# Altium schematic sheet SH9 - MICROCONTROLLER.SchDoc: Power Distribution Board Rev2 - MCU
size Letter; DrawnBy: Cindy Li; Organization: UW Robotics; Address1: 200 University Avenue; Address2: Waterloo; Address3: Ontario; Address4: Canada N2L 3G6; DocumentNumber: 9; SheetNumber: 9; SheetTotal: 11
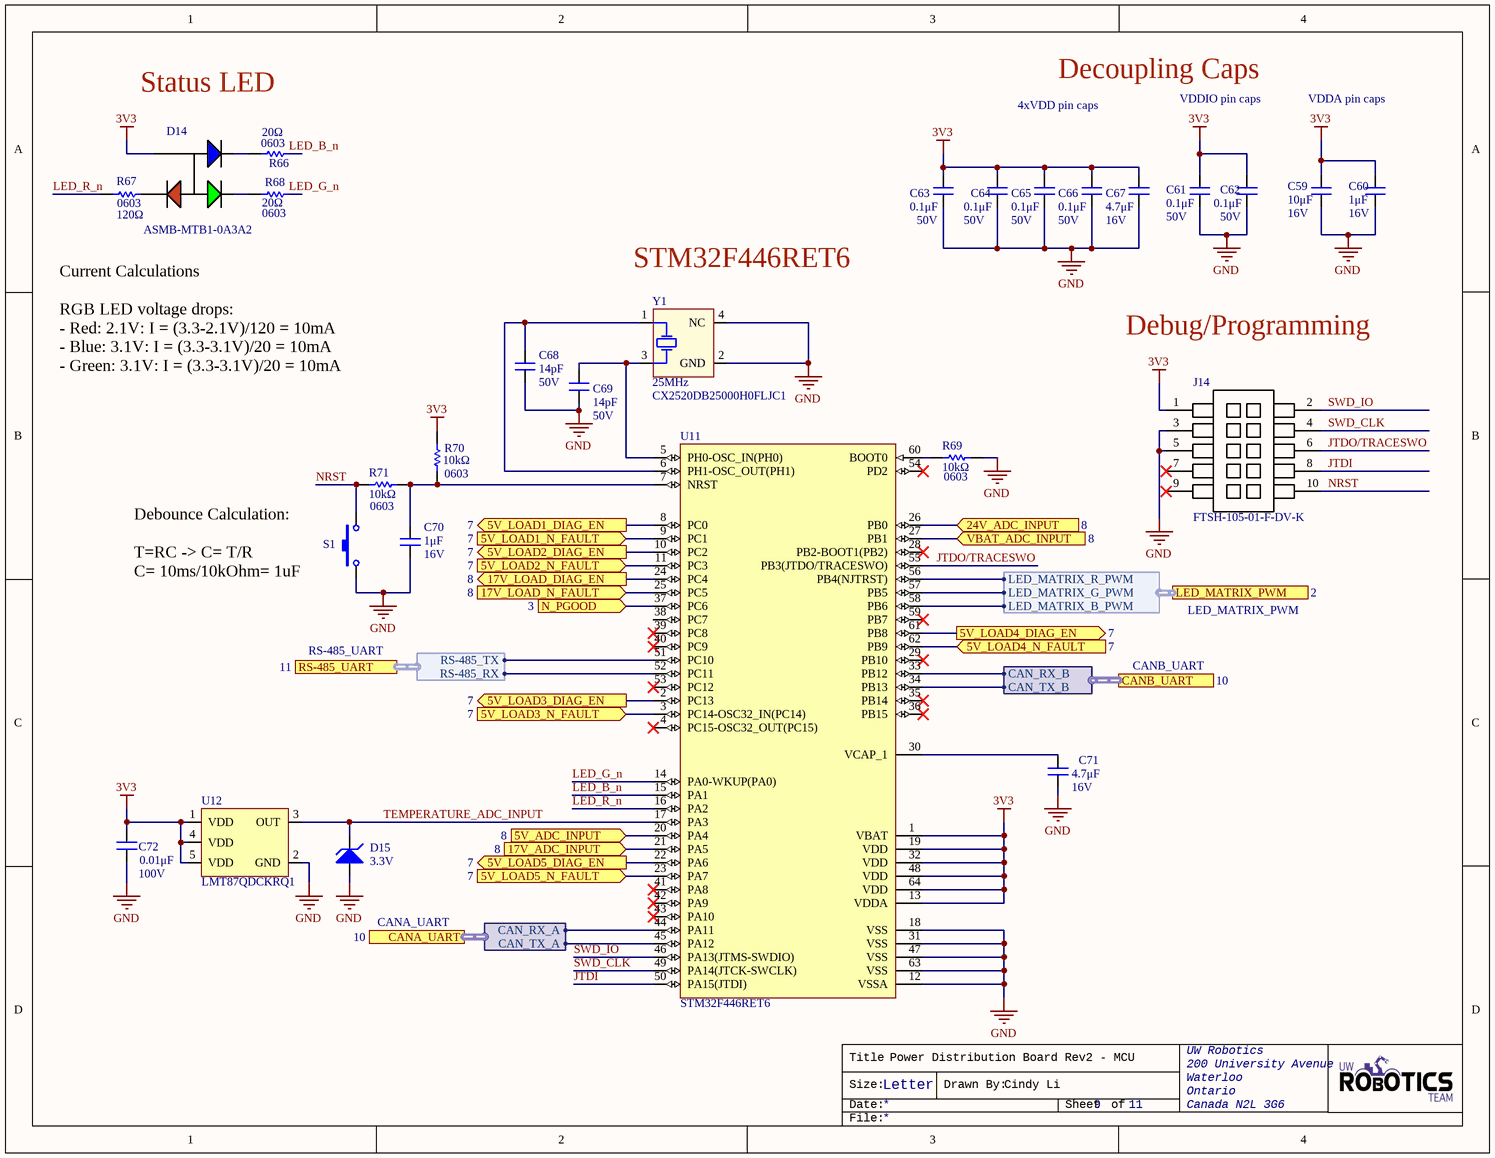
[diagram p0: SH9 - MICROCONTROLLER.SchDoc]

## Parts
C59  value 10μF  Voltage Rating: 16V  [CAP0603]  (hidden comment: CAP_10nF_0603)
C60  value 1μF  Voltage Rating: 16V  [CAP0603]  (hidden comment: CAP_1uF_16V_0603)
C61  value 0.1μF  Voltage Rating: 50V  [CAP0603]  (hidden comment: CAP_0.1uF_50V_0603)
C62  value 0.1μF  Voltage Rating: 50V  [CAP0603]  (hidden comment: CAP_0.1uF_50V_0603)
C63  value 0.1μF  Voltage Rating: 50V  [CAP0603]  (hidden comment: CAP_0.1uF_50V_0603)
C64  value 0.1μF  Voltage Rating: 50V  [CAP0603]  (hidden comment: CAP_0.1uF_50V_0603)
C65  value 0.1μF  Voltage Rating: 50V  [CAP0603]  (hidden comment: CAP_0.1uF_50V_0603)
C66  value 0.1μF  Voltage Rating: 50V  [CAP0603]  (hidden comment: CAP_0.1uF_50V_0603)
C67  value 4.7μF  Voltage Rating: 16V  [CAP2012]  (hidden comment: CAP_4.7uF_16V_0805)
C68  value 14pF  Voltage Rating: 50V  [CAP0603]  (hidden comment: CAP_14pF_50V_0603)
C69  value 14pF  Voltage Rating: 50V  [CAP0603]  (hidden comment: CAP_14pF_50V_0603)
C70  value 1μF  Voltage Rating: 16V  [CAP2012]  (hidden comment: CAP_1uF_16V_0805)
C71  value 4.7μF  Voltage Rating: 16V  [CAP2012]  (hidden comment: CAP_4.7uF_16V_0805)
C72  value 0.01μF  Voltage Rating: 100V  [CAP0603]  (hidden comment: CAP_0.01uF_100V_0603)
D14  Manufacturer Part Number 1: ASMB-MTB1-0A3A2  [LED_RGB]  (hidden comment: LED_RGB)
D15  Reverse Standoff Voltage: 3.3V  [SOD523_UNI]  (hidden comment: ESD5Z3.3T1G)
J14  Manufacturer Part Number 1: FTSH-105-01-F-DV-K  [FTSH-105-01-F-DV-K-P-TR]  (hidden comment: CON_PROGRAMMING)
R66  value 20Ω  Case Code (Imperial): 0603  [RESC0603(1608)_N]  (hidden comment: RES_20Ω_0603)
R67  value 120Ω  Case Code (Imperial): 0603  [RESC0603(1608)_N]  (hidden comment: RES_120Ω_0603)
R68  value 20Ω  Case Code (Imperial): 0603  [RESC0603(1608)_N]  (hidden comment: RES_20Ω_0603)
R69  value 10kΩ  Case Code (Imperial): 0603  [RESC0603(1608)_N]  (hidden comment: RES_10kΩ_0603)
R70  value 10kΩ  Case Code (Imperial): 0603  [RESC0603(1608)_N]  (hidden comment: RES_10kΩ_0603)
R71  value 10kΩ  Case Code (Imperial): 0603  [RESC0603(1608)_N]  (hidden comment: RES_10kΩ_0603)
S1  SW_TACTILE  [B3U-1000P]  (value not drawn)
U11  STM32F446RET6  [STM-LQFP64_L]
U12  Manufacturer Part Number 1: LMT87QDCKRQ1  [SOT65P210X110-5N]  (hidden comment: IC TEMPERATURE_SENSOR)
Y1  Frequency: 25MHz  Manufacturer Part Number 1: CX2520DB25000H0FLJC1  [SOIC254P1016X440-4N]  (hidden comment: CRYSTAL_25MHZ)

## Ports
5V_ADC_INPUT (in, see 8), 5V_LOAD1_DIAG_EN (out, see 7), 5V_LOAD1_N_FAULT (in, see 7), 5V_LOAD2_DIAG_EN (out, see 7), 5V_LOAD2_N_FAULT (in, see 7), 5V_LOAD3_DIAG_EN (out, see 7), 5V_LOAD3_N_FAULT (in, see 7), 5V_LOAD4_DIAG_EN (out, see 7), 5V_LOAD4_N_FAULT (in, see 7), 5V_LOAD5_DIAG_EN (out, see 7), 5V_LOAD5_N_FAULT (in, see 7), 17V_ADC_INPUT (in, see 8), 17V_LOAD_DIAG_EN (out, see 8), 17V_LOAD_N_FAULT (in, see 8), 24V_ADC_INPUT (in, see 8), CANA_UART (harness CANA_UART, see 10), CANB_UART (harness CANB_UART, see 10), LED_MATRIX_PWM (harness LED_MATRIX_PWM, see 2), N_PGOOD (in, see 3), RS-485_UART (harness RS-485_UART, see 11), VBAT_ADC_INPUT (in, see 8)

## Harnesses
CANA_UART: CAN_RX_A, CAN_TX_A
CANB_UART: CAN_RX_B, CAN_TX_B
LED_MATRIX_PWM: LED_MATRIX_R_PWM, LED_MATRIX_G_PWM, LED_MATRIX_B_PWM
RS-485_UART: RS-485_TX, RS-485_RX

## Nets
3V3: C59.2 C60.2 C61.2 C62.2 C63.2 C64.2 C65.2 C66.2 C67.2 C72.2 D14.4(COMMON_ANODE) J14.1 R70.2 U11.1(VBAT) U11.13(VDDA) U11.19(VDD) U11.32(VDD) U11.48(VDD) U11.64(VDD) U12.1(VDD) U12.4(VDD) U12.5(VDD)
GND: C59.1 C60.1 C61.1 C62.1 C63.1 C64.1 C65.1 C66.1 C67.1 C68.1 C69.1 C70.1 C71.1 C72.1 D15.1 J14.3 J14.5 R69.2 S1.1 U11.12(VSSA) U11.18(VSS) U11.31(VSS) U11.47(VSS) U11.63(VSS) U12.2(GND) Y1.2(GND) Y1.4(NC)
5V_ADC_INPUT: U11.20(PA4) ; port 5V_ADC_INPUT
5V_LOAD1_DIAG_EN: U11.8(PC0) ; port 5V_LOAD1_DIAG_EN
5V_LOAD1_N_FAULT: U11.9(PC1) ; port 5V_LOAD1_N_FAULT
5V_LOAD2_DIAG_EN: U11.10(PC2) ; port 5V_LOAD2_DIAG_EN
5V_LOAD2_N_FAULT: U11.11(PC3) ; port 5V_LOAD2_N_FAULT
5V_LOAD3_DIAG_EN: U11.2(PC13) ; port 5V_LOAD3_DIAG_EN
5V_LOAD3_N_FAULT: U11.3(PC14-OSC32_IN(PC14)) ; port 5V_LOAD3_N_FAULT
5V_LOAD4_DIAG_EN: U11.61(PB8) ; port 5V_LOAD4_DIAG_EN
5V_LOAD4_N_FAULT: U11.62(PB9) ; port 5V_LOAD4_N_FAULT
5V_LOAD5_DIAG_EN: U11.22(PA6) ; port 5V_LOAD5_DIAG_EN
5V_LOAD5_N_FAULT: U11.23(PA7) ; port 5V_LOAD5_N_FAULT
17V_ADC_INPUT: U11.21(PA5) ; port 17V_ADC_INPUT
17V_LOAD_DIAG_EN: U11.24(PC4) ; port 17V_LOAD_DIAG_EN
17V_LOAD_N_FAULT: U11.25(PC5) ; port 17V_LOAD_N_FAULT
24V_ADC_INPUT: U11.26(PB0) ; port 24V_ADC_INPUT
JTDI: J14.8 U11.50(PA15(JTDI))
JTDO/TRACESWO: J14.6 U11.55(PB3(JTDO/TRACESWO))
LED_B_n: R66.2 U11.15(PA1)
LED_G_n: R68.2 U11.14(PA0-WKUP(PA0))
LED_R_n: R67.1 U11.16(PA2)
N_PGOOD: U11.37(PC6) ; port N_PGOOD
NRST: J14.10 R71.2 S1.2
SWD_CLK: J14.4 U11.49(PA14(JTCK-SWCLK))
SWD_IO: J14.2 U11.46(PA13(JTMS-SWDIO))
TEMPERATURE_ADC_INPUT: D15.2 U11.17(PA3) U12.3(OUT)
VBAT_ADC_INPUT: U11.27(PB1) ; port VBAT_ADC_INPUT
NetC68_2: C68.2 U11.6(PH1-OSC_OUT(PH1)) Y1.1(HOT)
NetC69_2: C69.2 U11.5(PH0-OSC_IN(PH0)) Y1.3(HOT)
NetC70_2: C70.2 R70.1 R71.1 U11.7(NRST)
NetC71_2: C71.2 U11.30(VCAP_1)
NetD14_1: D14.1(CATHODE_(RED)) R67.2
NetD14_2: D14.2(CATHODE_(GREEN)) R68.1
NetD14_3: D14.3(CATHODE_(BLUE)) R66.1
NetR69_1: R69.1 U11.60(BOOT0)
NetU11_33: U11.33(PB12) ; port CANB_UART.CAN_RX_B
NetU11_34: U11.34(PB13) ; port CANB_UART.CAN_TX_B
NetU11_44: U11.44(PA11) ; port CANA_UART.CAN_RX_A
NetU11_45: U11.45(PA12) ; port CANA_UART.CAN_TX_A
NetU11_51: U11.51(PC10) ; port RS-485_UART.RS-485_TX
NetU11_52: U11.52(PC11) ; port RS-485_UART.RS-485_RX
NetU11_56: U11.56(PB4(NJTRST)) ; port LED_MATRIX_PWM.LED_MATRIX_R_PWM
NetU11_57: U11.57(PB5) ; port LED_MATRIX_PWM.LED_MATRIX_G_PWM
NetU11_58: U11.58(PB6) ; port LED_MATRIX_PWM.LED_MATRIX_B_PWM

Not connected (* = marked no-connect by the designer): J14 7* 9*; U11 4(PC15-OSC32_OUT(PC15))* 28(PB2-BOOT1(PB2))* 29(PB10)* 35(PB14)* 36(PB15)* 38(PC7) 39(PC8)* 40(PC9)* 41(PA8)* 42(PA9)* 43(PA10)* 53(PC12)* 54(PD2)* 59(PB7)*

## Notes on the sheet
- Status LED
- Decoupling Caps
- VDDIO pin caps
- VDDA pin caps
- 4xVDD pin caps
- (near Y1) STM32F446RET6
- Debug/Programming
- Current Calculations
  RGB LED voltage drops:
  - Red: 2.1V: I = (3.3-2.1V)/120 = 10mA
  - Blue: 3.1V: I = (3.3-3.1V)/20 = 10mA
  - Green: 3.1V: I = (3.3-3.1V)/20 = 10mA
- Debounce Calculation:
  T=RC -> C= T/R
  C= 10ms/10kOhm= 1uF
- Title
- Size:
- Date:
- Letter
- Drawn By:
- Sheet
- of
- File:

## Library data of the parts
C59 = CAP_10nF_0603: CAP CER 10000PF 16V X7R 0603; Manufacturer Part Number 1: CC0603KRX7R7BB103; Manufacturer 1: Yageo; Dimensions: 0.063" L x 0.031" W (1.60mm x 0.80mm); Package: 0603 (1608 Metric); Temperature Coefficient: X7R; Supplier Part Number 1: 311-3369-1-ND; Supplier 1: Digi-Key; Mount: Surface Mount; Case Code (Imperial): 0603; Case Code (Metric): 1608; Dielectric: X7R
C60 = CAP_1uF_16V_0603: CAP CER 1UF 16V Y5V 0603; Manufacturer Part Number: CC0603ZRY5V7BB105; Manufacturer 1: Yageo; Dimensions: 0.063" L x 0.031" W (1.60mm x 0.80mm); Package: 0603 (1608 Metric); Temperature Coefficient: Y5V; Supplier Part Number 1: 311-1372-1-ND; Supplier 1: Digi-Key; Mount: Surface Mount; Case Code (Imperial): 0603; Case Code (Metric): 1608; Manufacturer Part Number 1: CC0603ZRY5V7BB105; Dielectric: Y5V
C61-C66 = CAP_0.1uF_50V_0603: CAP CER 0.1UF 50V X7R 0603; Manufacturer Part Number 1: CC0603KRX7R9BB104; Manufacturer 1: Yageo; Dimensions: 0.063" L x 0.031" W (1.60mm x 0.80mm); Package: 0603 (1608 Metric); Temperature Coefficient: X7R; Supplier Part Number 1: 311-1344-1-ND; Supplier 1: Digi-Key; Mount: Surface Mount; Case Code (Imperial): 0603; Case Code (Metric): 1608; Dielectric: X7R
C67 C71 = CAP_4.7uF_16V_0805: CAP CER 4.7UF 16V X5R 0805; Manufacturer Part Number 1: CL21A475KOFNNNE; Manufacturer 1: Samsung Electro-Mechanics; Tolerance: 10%; Package: 0805 (2012 Metric); Supplier Part Number 1: 1276-1065-1-ND; Supplier 1: Digi-Key; Mount: Surface Mount; Case Code (Imperial): 0805; Case Code (Metric): 2012; Dielectric: X5R; Min Operating Temperature: -55°C; Max Operating Temperature: 85°C; Termination: SMD/SMT
C68 C69 = CAP_14pF_50V_0603: CAP CER 14PF 50V C0G/NP0 0603; Manufacturer 1: Samsung; Manufacturer Part Number 1: CL10C140JB8NNNC; Tolerance: 5%; Dielectric: C0G; Supplier 1: Digi-Key; Mount: Surface Mount; Case Code (Metric): 1608; Case Code (Imperial): 0603; Min Operating Temperature: -55°C; Max Operating Temperature: 125°C; Voltage Rating (DC): 50V; Length: 1.6mm; Height: 0.8mm; Width: 0.031inch; Depth: 0.8mm; Thickness: 0.035inch; Supplier Part Number 1: 1276-2187-1-ND; Package: 0603 (1608 Metric)
C70 = CAP_1uF_16V_0805: CAP CER 1UF 16V X7R 0805; Manufacturer 1: Yageo; Manufacturer Part Number 1: CC0805KKX7R7BB105; Tolerance: 10%; Mount: Surface Mount; Case Code (Metric): 2012; Case Code (Imperial): 0805; Min Operating Temperature: -55°C; Max Operating Temperature: 125°C; Dielectric: X7R; Termination: SMD/SMT; Supplier 1: Digi-Key; Supplier Part Number 1: 311-1365-1-ND; Package: 0805 (2012 Metric)
C72 = CAP_0.01uF_100V_0603: CAP CER 10000PF 100V X7R 0603; Manufacturer Part Number 1: GCM188R72A103KA37J; Manufacturer 1: Murata Electronics; Dimensions: 0.063" L x 0.031" W (1.60mm x 0.80mm); Package: 0603 (1608 Metric); Supplier Part Number 1: 490-8028-1-ND; Supplier 1: Digi-Key; Mount: Surface Mount; Case Code (Imperial): 0603; Case Code (Metric): 1608; Dielectric: X7R; Temperature Coefficient: X7R
D14 = LED_RGB: LED RGB DIFFUSED 4PLCC SMD; Manufacturer 1: Broadcom; Color: Blue,Green,Red; Lens Color: White; Viewing Angle: 115°; Lens Style: Round; Luminous Intensity: 350mcd; Dominant Wavelength: 470nm; Forward Voltage: 3.1V; Test Current: 20mA; Supplier 1: Digi-Key; Mount: Surface Mount; Case/Package: PLCC; Number of Pins: 4; Lens Transparency: Diffused; Length: 3.2mm; Height: 1.9mm; Width: 2.8mm; REACH SVHC: No SVHC; Supplier Part Number 1: 516-3280-1-ND
D15 = ESD5Z3.3T1G: ESD5Z3.3T1G,SOD523 ESD DIODE < AZ; Manufacturer 1: ON Semiconductor; Clamping Voltage: 14.1V; Peak Pulse Power: 158W; Number of Unidirectional Channels: 1; Min Breakdown Voltage: 5V; Power Line Protection: No; Peak Pulse Current: 11.2A; Polarity: Unidirectional; ESD Protection: Yes; Capacitance: 105pF; Max Reverse Leakage Current: 50nA; Test Current: 1mA; Max Power Dissipation: 200mW; Element Configuration: Single; Supplier 1: Digi-Key; Category: ESD and Circuit Protection ICs; Case/Package: SOD-523-2; Number of Pins: 2; Contact Plating: Tin,Matte; Min Operating Temperature: -55°C; Max Operating Temperature: 150°C; Composition: Zener; Number of Lines: 1; Breakdown Voltage: 5V; Termination: SMD/SMT; Number of Elements: 1; Max Breakdown Voltage: 5V; Reverse Breakdown Voltage: 5V; Leakage Current: 50nA; Number of Channels: 1; Operating Supply Voltage: 3.3V; Max Surge Current: 11.2A; Working Voltage: 3.3V; Direction: Unidirectional; Length: 1.2mm; Height: 0.6mm; Width: 0.8mm; Depth: 0.8mm; Halogen Free: Halogen Free; REACH SVHC: No SVHC; ComponentLink7URL: https://datasheet.ciiva.com/3304/esd5z2-5t1-d-3304008.pdf?src-supplier=Avnet; ComponentLink7Description: https://datasheet.ciiva.com/3304/esd5z2-5t1-d-3304008.pdf?src-supplier=Avnet; ComponentLink8URL: https://datasheet.ciiva.com/339/esd5z2-5t1-d-339753.pdf?src-supplier=Digi-Key; ComponentLink8Description: https://datasheet.ciiva.com/339/esd5z2-5t1-d-339753.pdf?src-supplier=Digi-Key; ComponentLink9URL: https://datasheet.ciiva.com/22637/1878252-22637179.pdf?src-supplier=Element14; ComponentLink9Description: https://datasheet.ciiva.com/22637/1878252-22637179.pdf?src-supplier=Element14; ComponentLink10URL: https://datasheet.ciiva.com/16472/esd5z2-5t1-d-16472397.pdf?src-supplier=Avnet+Asia; ComponentLink10Description: https://datasheet.ciiva.com/16472/esd5z2-5t1-d-16472397.pdf?src-supplier=Avnet+Asia; ComponentLink11URL: https://datasheet.ciiva.com/22637/1878252-22637181.pdf?src-supplier=Element14; ComponentLink11Description: https://datasheet.ciiva.com/22637/1878252-22637181.pdf?src-supplier=Element14; Supplier Part Number 1: ESD5Z3.3T1GOSCT-ND; Manufacturer Part Number 1: ESD5Z3.3T1G
J14 = CON_PROGRAMMING: Board Connector, 10 Contact(s), 2 Row(s), Male, Straight, 0.05 inch Pitch, Surface Mount Terminal, Locking; Manufacturer 1: Samtec; Number of Contacts: 10; Connector Type: Male Pin; Max Current Rating: 1.75A; Pitch: 1.27mm; Supplier 1: Digi-Key; RoHS: Yes; Category: Headers and Wire Housings; Stock 1: 19926; Pricing 1: 1=2.90000, 10=2.78400, 100=2.32000, 500=1.97200, 1000=1.68200, 5000=1.50800 (USD); Mount: Surface Mount; Contact Plating: Gold; Contact Material: Copper,Bronze; Housing Color: Black; Housing Material: Polymer; Color: Black; Min Operating Temperature: -55°C; Max Operating Temperature: 125°C; Number of Rows: 2; Termination: Solder; Packaging: Rail/Tube; Orientation: Straight; Package Quantity: 1; Number of Positions: 10; Length: 15.2mm; Height: 3.3mm; Depth: 3.43mm; Row Spacing: 0.05inch; Contact Mating Length: 0.12inch; Radiation Hardening: No; Lead Free: Lead Free; ComponentLink1URL: https://datasheet.ciiva.com:443/pdfs/VipMasterIC/IC/SAMI/SAMI-S-A0003531380/SAMI-S-A0003531380-1.pdf?src-supplier=IHS+Markit; ComponentLink1Description: https://datasheet.ciiva.com:443/pdfs/VipMasterIC/IC/SAMI/SAMI-S-A0003531380/SAMI-S-A0003531380-1.pdf?src-supplier=IHS+Markit; ComponentLink2URL: https://datasheet.ciiva.com/19461/2046846-19461026.pdf?src-supplier=Jameco; ComponentLink2Description: https://datasheet.ciiva.com/19461/2046846-19461026.pdf?src-supplier=Jameco; ComponentLink3URL: https://datasheet.ciiva.com/16657/ftsh-mt-16657371.pdf?src-supplier=Avnet+Europe; ComponentLink3Description: https://datasheet.ciiva.com/16657/ftsh-mt-16657371.pdf?src-supplier=Avnet+Europe; ComponentLink4URL: https://datasheet.ciiva.com/15195/getdatasheetpartid-133463-15195260.pdf?src-supplier=Verical; ComponentLink4Description: https://datasheet.ciiva.com/15195/getdatasheetpartid-133463-15195260.pdf?src-supplier=Verical; ComponentLink5URL: https://datasheet.ciiva.com/738/ftsh-1xx-xx-xxx-dv-xxx-mkt-738998.pdf?src-supplier=Digi-Key; ComponentLink5Description: https://datasheet.ciiva.com/738/ftsh-1xx-xx-xxx-dv-xxx-mkt-738998.pdf?src-supplier=Digi-Key; ComponentLink6URL: https://datasheet.ciiva.com/10245/ftsh-mt-10245273.pdf?src-supplier=Avnet; ComponentLink6Description: https://datasheet.ciiva.com/10245/ftsh-mt-10245273.pdf?src-supplier=Avnet; Supplier Part Number 1: SAM8796-ND
R66 R68 = RES_20Ω_0603: RES SMD 20 OHM 5% 1/10W 0603; Manufacturer 1: Yageo; Manufacturer Part Number 1: RC0603JR-0720RL; Package: 0603 (1608 Metric); Dimensions: 0.063" L x 0.031" W (1.60mm x 0.80mm); Tolerance: 5%; Supplier Part Number 1: 311-20GRCT-ND; Supplier 1: Digi-Key; Mount: Surface Mount; Case Code (Metric): 1608
R67 = RES_120Ω_0603: RES SMD 120 OHM 5% 1/10W 0603; Manufacturer 1: Yageo; Manufacturer Part Number 1: RC0603JR-07120RL; Package: 0603 (1608 Metric); Dimensions: 0.063" L x 0.031" W (1.60mm x 0.80mm); Tolerance: 5%; Supplier Part Number 1: 311-120GRCT-ND; Supplier 1: Digi-Key; Mount: Surface Mount; Case Code (Metric): 1608
R69 R70 = RES_10kΩ_0603: RES SMD 10K OHM 5% 1/10W 0603; Manufacturer 1: Yageo; Manufacturer Part Number 1: RC0603JR-0710KL; Package: 0603 (1608 Metric); Dimensions: 0.063" L x 0.031" W (1.60mm x 0.80mm); Tolerance: 5%; Supplier Part Number 1: 311-10KGRCT-ND; Supplier 1: Digi-Key; Mount: Surface Mount; Case Code (Metric): 1608
R71 = RES_10kΩ_0603_5%: RES 10K OHM 5% 1/10W 0603; Manufacturer 1: Yageo; Manufacturer Part Number 1: RC0603JR-0710KL; Package: 0603 (1608 Metric); Dimensions: 0.063" L x 0.031" W (1.60mm x 0.80mm); Supplier Part Number 1: 311-10KGRCT-ND; Supplier 1: Digi-Key; Mount: Surface Mount; Case Code (Metric): 1608; Tolerance: 5%
S1 = SW_TACTILE: Tactile Switch (Grey); Manufacturer 1: Omron Electronics Inc-EMC Div; Manufacturer Part Number 1: B3U-1000P; Supplier 1: Digi-Key; Supplier Part Number 1: SW1020CT-ND; Mount: Surface Mount
U11 = MCU_STM32F446RET6: ARM Cortex-M4 32-bit MCU+FPU, 512 KB Flash, 128 KB Internal RAM, 50 I/Os, 64-Pin LQFP, -40 to 85 degC, Tray; I/Os (High Current): 50; Supply Voltage(Vcc) min (V): 1.7; Operating Frequency(F) (Processor speed) (MHz): 180; D/A Converter: 2; Internal RAM Size (kB): 128; FLASH Size (Prog) (kB): 512; Core: ARM Cortex-M4; ComponentLink1Description: Manufacturer URL; Package Reference: 64-Pin Low-profile Quad Flat Package, Body 10 x 10 mm, Pitch 0.5 mm; ComponentLink2URL: http://www.st.com/st-web-ui/static/active/en/resource/technical/document/datasheet/DM00141306.pdf; Packing: Tray; DatasheetVersion: Rev. 6; ComponentLink1URL: http://www.st.com/; ComponentLink2Description: Datasheet; Package Description: LQFP64; Mounting Technology: Surface Mount; Supplier Part Number 1: 497-15376-ND; Supplier 1: Digi-Key
U12 = IC TEMPERATURE_SENSOR: SENSOR ANALOG -50C-150C SC70; Manufacturer 1: Texas Instruments; Sensing Temperature - Local: -50°C ~ 150°C; Output Type: Analog Voltage; Supply Voltage: 2.7V - 5.5V; Resolution: 13.6mV/°C; Supplier Part Number 1: 296-40298-1-ND; Supplier 1: Digi-Key; Mount: Surface Mount
Y1 = CRYSTAL_25MHZ: CRYSTAL 25.0000MHZ 12PF SMD; Manufacturer 1: Kyocera AVX; ESR (Equivalent Series Resistance): 80R; Frequency Stability: 15ppm; Frequency Tolerance: 10ppm; Mount: Surface Mount; Case/Package: SMD/SMT; Min Operating Temperature: -30°C; Max Operating Temperature: 85°C; Load Capacitance: 12pF; Length: 0.098inch; Height: 0.022inch; Width: 0.079inch; Ratings: AEC-Q200; Supplier 1: Digi-Key; Supplier Part Number 1: 1253-1724-1-ND